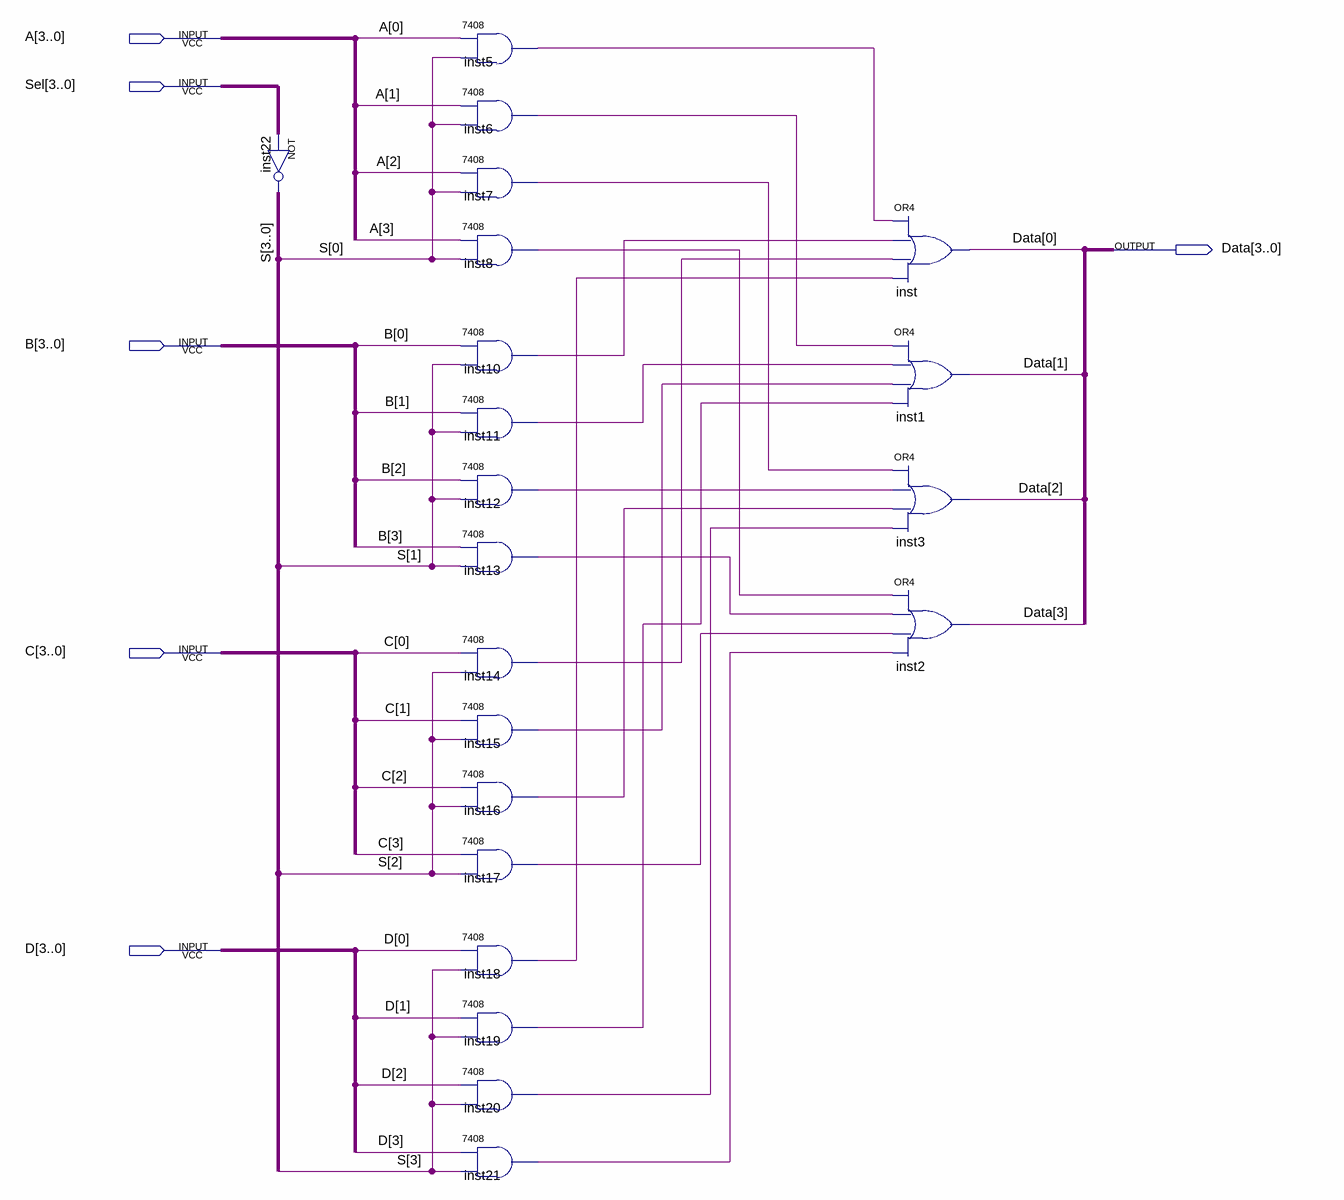
[diagram p0: schematic sheet]
// Quartus schematic Multiplex.bdf as structural Verilog: 21 symbols, 6 pins
module Multiplex (
  input  [3:0] A,
  input  [3:0] Sel,
  input  [3:0] B,
  input  [3:0] C,
  input  [3:0] D,
  output [3:0] Data
);

  wire inst5_1, inst6_1, inst7_1, inst8_1, inst10_1, inst11_1, inst12_1, inst13_1, inst14_1, inst15_1,
       inst16_1, inst17_1, inst18_1, inst19_1, inst20_1, inst21_1;
  wire [3:0] S;

  assign S = ~Sel;  // NOT inst22, 4 bits wide
  \7408  inst5 (.\3 (S[0]), .\2 (A[0]), .\1 (inst5_1));
  \7408  inst6 (.\3 (S[0]), .\2 (A[1]), .\1 (inst6_1));
  \7408  inst7 (.\3 (S[0]), .\2 (A[2]), .\1 (inst7_1));
  \7408  inst8 (.\3 (S[0]), .\2 (A[3]), .\1 (inst8_1));
  \7408  inst10 (.\3 (S[1]), .\2 (B[0]), .\1 (inst10_1));
  \7408  inst11 (.\3 (S[1]), .\2 (B[1]), .\1 (inst11_1));
  \7408  inst12 (.\3 (S[1]), .\2 (B[2]), .\1 (inst12_1));
  \7408  inst13 (.\3 (S[1]), .\2 (B[3]), .\1 (inst13_1));
  \7408  inst14 (.\3 (S[2]), .\2 (C[0]), .\1 (inst14_1));
  \7408  inst15 (.\3 (S[2]), .\2 (C[1]), .\1 (inst15_1));
  \7408  inst16 (.\3 (S[2]), .\2 (C[2]), .\1 (inst16_1));
  \7408  inst17 (.\3 (S[2]), .\2 (C[3]), .\1 (inst17_1));
  \7408  inst18 (.\3 (S[3]), .\2 (D[0]), .\1 (inst18_1));
  \7408  inst19 (.\3 (S[3]), .\2 (D[1]), .\1 (inst19_1));
  \7408  inst20 (.\3 (S[3]), .\2 (D[2]), .\1 (inst20_1));
  \7408  inst21 (.\3 (S[3]), .\2 (D[3]), .\1 (inst21_1));
  or inst (Data[0], inst5_1, inst10_1, inst14_1, inst18_1);
  or inst1 (Data[1], inst6_1, inst11_1, inst15_1, inst19_1);
  or inst3 (Data[2], inst7_1, inst12_1, inst16_1, inst20_1);
  or inst2 (Data[3], inst8_1, inst13_1, inst17_1, inst21_1);
endmodule
